# EasyEDA schematic Equilibrium-PCB.json
TITLE: Equilibrium; REV: 1.0; Date: 2025-05-12; Sheet: 1/1; Company: Your Company
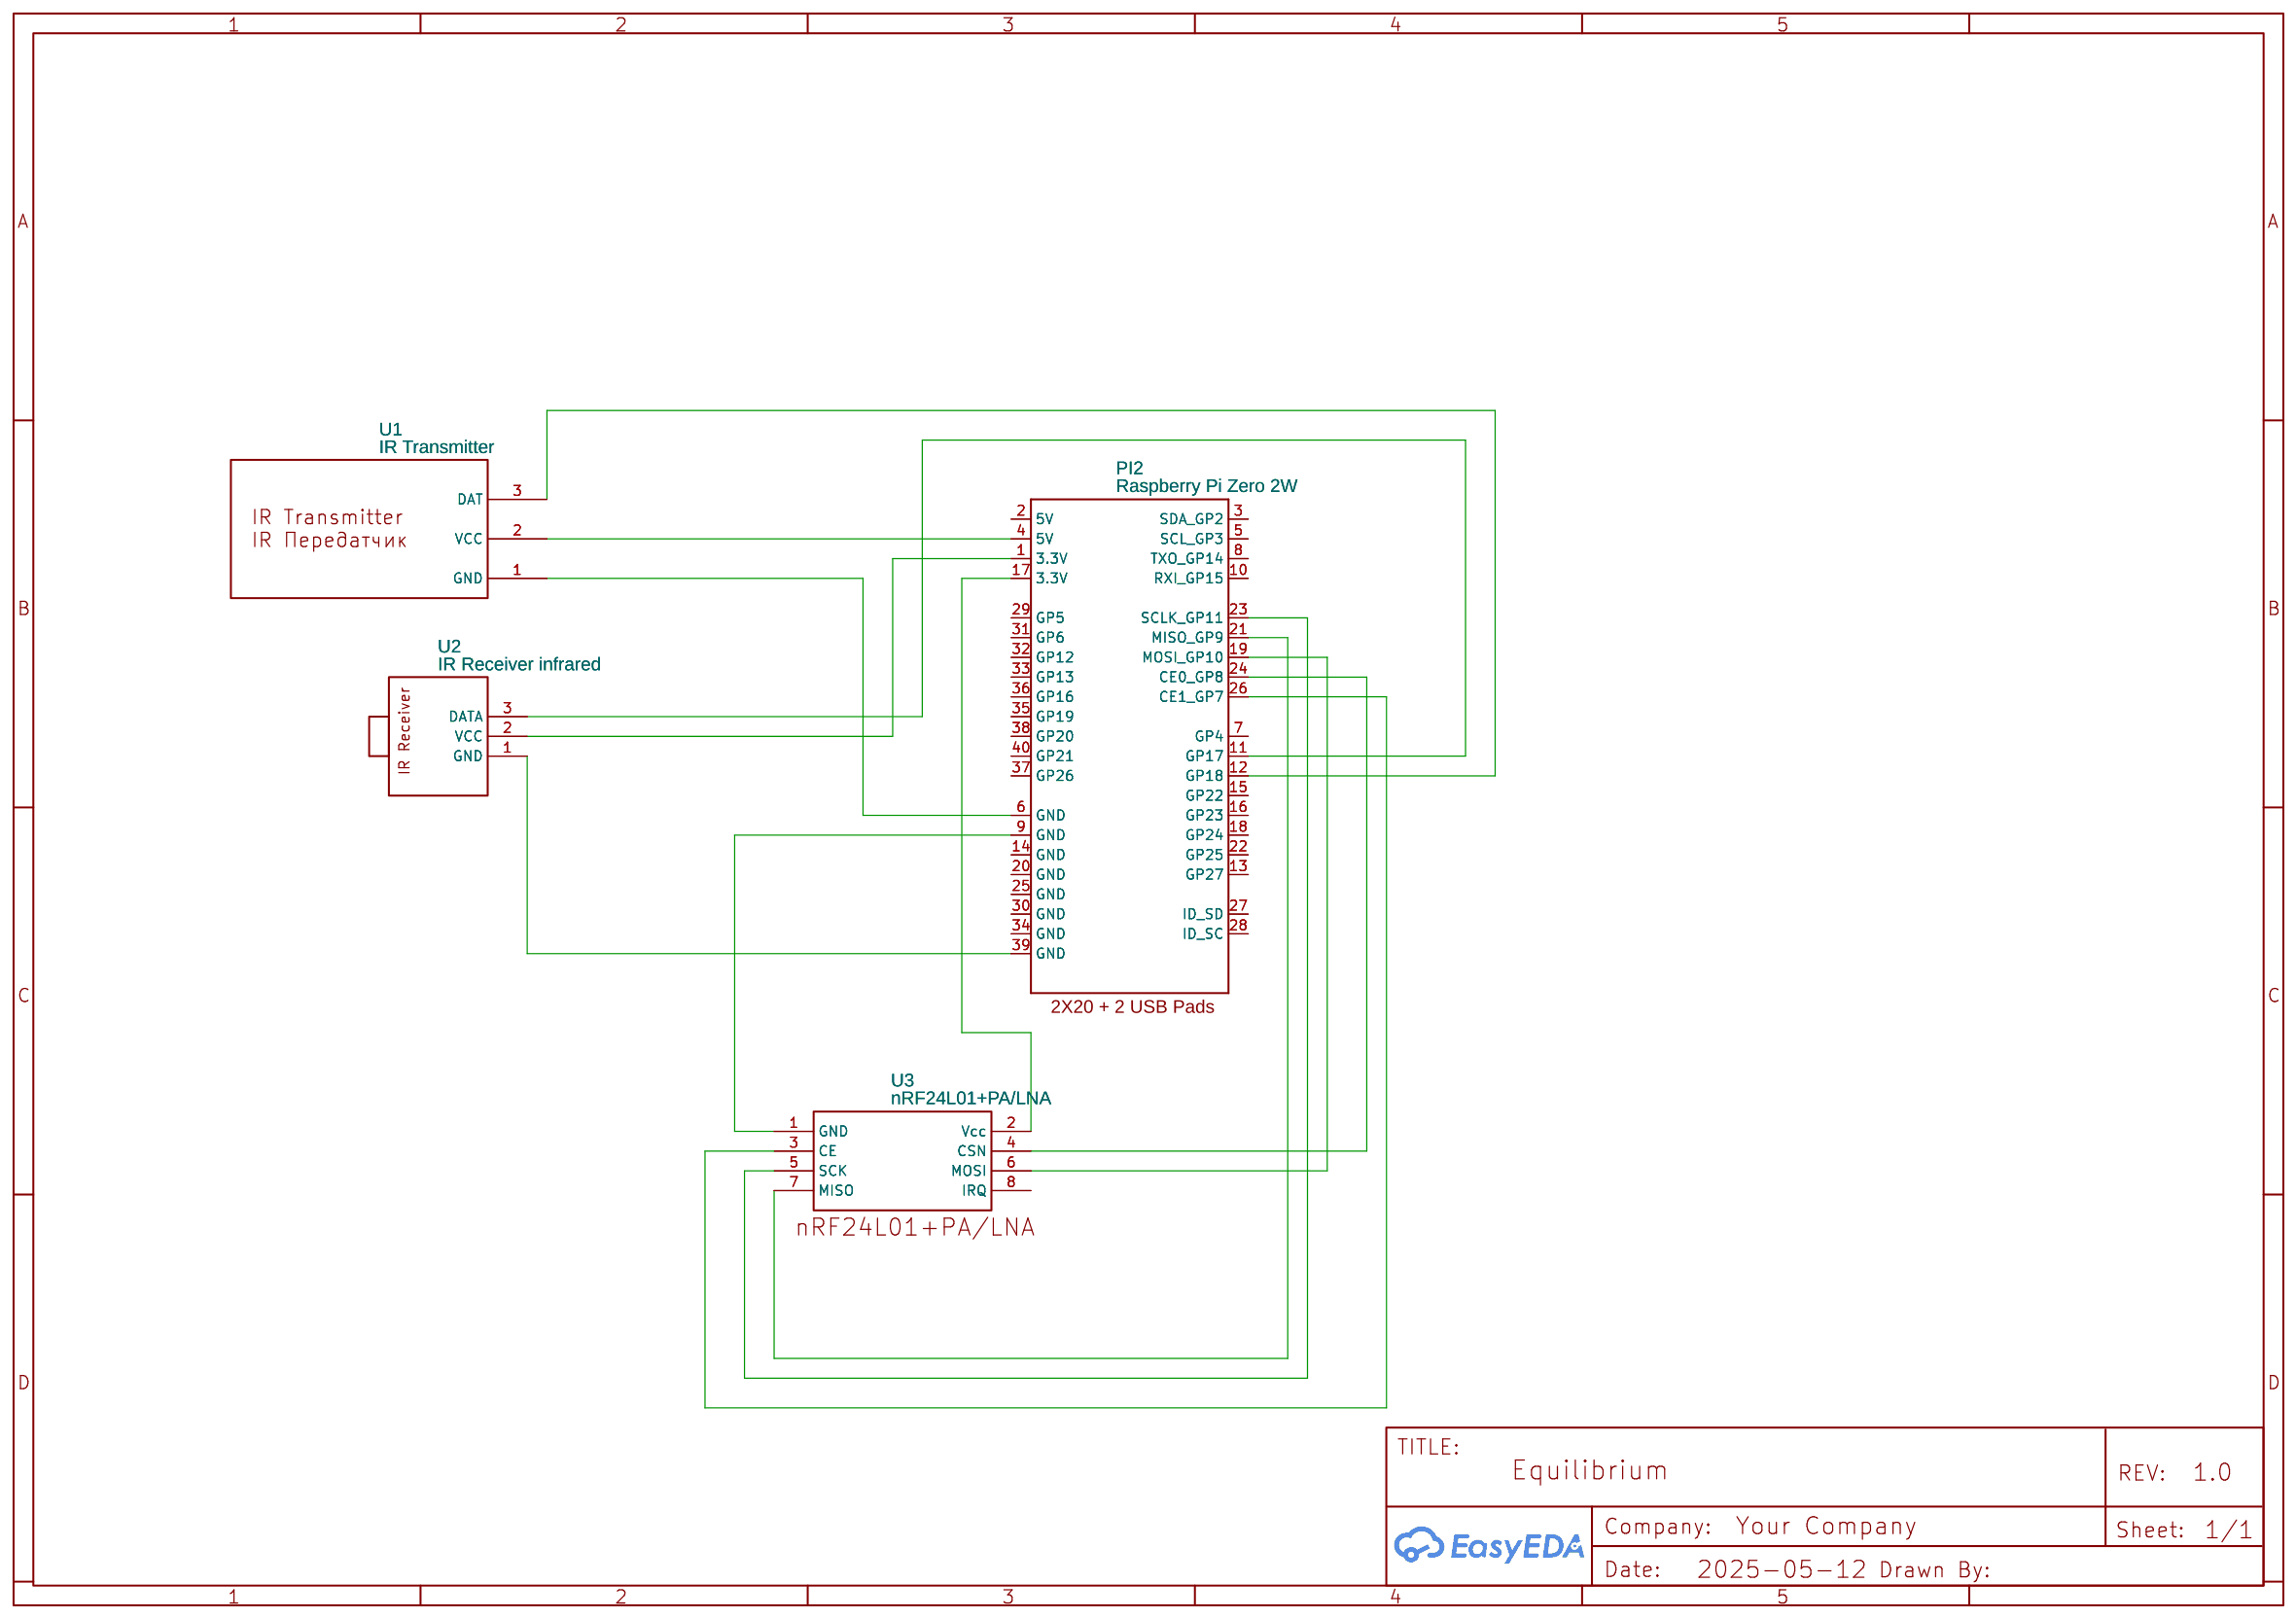
[diagram p0: schematic sheet]

## Parts
PI2  Raspberry Pi Zero 2W  [RASPERY PI ZERO 2W]
U1  IR Transmitter  [IR TRANSMITTER]
U2  IR Receiver infrared  [IR RECEIVER INFRARED]
U3  nRF24L01+PA/LNA  [NRF24L01+PA/LNA]

## Library data of the parts
PI2 = Raspberry Pi Zero 2W lka: Manufacturer: Raspberry Pi; Supplier: Digi-Key; Supplier Part: SC0510; link: https://www.raspberrypi.com/products/raspberry-pi-zero-2-w/; Contributor: lokatrok
U1 = IR Transmitter: Supplier: Китай; Contributor: nikolay.mediana
U2 = IR Receiver infrared: Supplier: Aideepen; Contributor: chaleekorn
U3 = nRF24L01+PA/LNA: Contributor: Dridri139090

## Nets
Net-(PI2-1): PI2.1(3.3V) U2.2(VCC)
Net-(PI2-4): PI2.4(5V) U1.2(VCC)
Net-(PI2-6): PI2.6(GND) U1.1(GND)
Net-(PI2-9): PI2.9(GND) U3.1(GND)
Net-(PI2-11): PI2.11(GP17) U2.3(DATA)
Net-(PI2-12): PI2.12(GP18) U1.3(DAT)
Net-(PI2-17): PI2.17(3.3V) U3.2(Vcc)
Net-(PI2-19): PI2.19(MOSI_GP10) U3.6(MOSI)
Net-(PI2-21): PI2.21(MISO_GP9) U3.7(MISO)
Net-(PI2-23): PI2.23(SCLK_GP11) U3.5(SCK)
Net-(PI2-24): PI2.24(CE0_GP8) U3.4(CSN)
Net-(PI2-26): PI2.26(CE1_GP7) U3.3(CE)
Net-(PI2-39): PI2.39(GND) U2.1(GND)

Not connected (* = marked no-connect by the designer): PI2 2(5V) 3(SDA_GP2) 5(SCL_GP3) 7(GP4) 8(TXO_GP14) 10(RXI_GP15) 13(GP27) 14(GND) 15(GP22) 16(GP23) 18(GP24) 20(GND) 22(GP25) 25(GND) 27(ID_SD) 28(ID_SC) 29(GP5) 30(GND) 31(GP6) 32(GP12) 33(GP13) 34(GND) 35(GP19) 36(GP16) 37(GP26) 38(GP20) 40(GP21); U3 8(IRQ)
